# Altium schematic sheet [03] - SDCARD.SchDoc
size A3
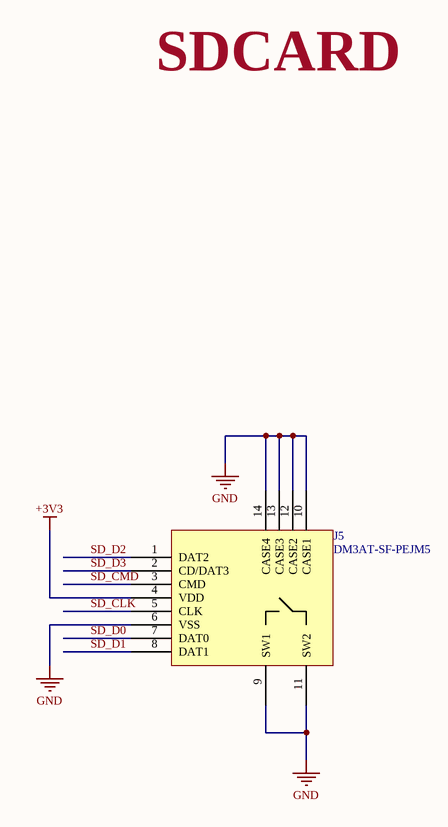
[diagram p0: [03] - SDCARD.SchDoc]

## Parts
J5  DM3AT-SF-PEJM5  [uSD_DM3AT]

## Nets
+3V3: J5.4(VDD)
GND: J5.6(VSS) J5.9(SW1) J5.10(CASE1) J5.11(SW2) J5.12(CASE2) J5.13(CASE3) J5.14(CASE4)
SD_CLK: J5.5(CLK)
SD_CMD: J5.3(CMD)
SD_D0: J5.7(DAT0)
SD_D1: J5.8(DAT1)
SD_D2: J5.1(DAT2)
SD_D3: J5.2(CD/DAT3)

## Notes on the sheet
- SDCARD

## Library data of the parts
J5 = DM3AT-SF-PEJM5: CONN MICRO SD R/A PUSH-PUSH SMD; Manufacturer: Hirose Electric Co Ltd; .Checked PCB: MM; Connector Type: Connector and Ejector; Card Type: Secure Digital - microSD TransFlash; Number of Positions: 10 (8 + 2); Insertion, Removal Method: Push In, Push Out; .Checked SCH: MM; Category: Connectors, Interconnects; Supplier Part Number: HR1964CT-ND; Family: Memory - PC Card Connectors; Manufacturer Part Number: DM3AT-SF-PEJM5; Price 1k [$]: 1.85200; Supplier: Digikey; Supplier 1: Digi-Key; Supplier Part Number 1: HR1964CT-ND; RoHS: RoHS Compliant; Stock 1: 7044; Pricing 1: 1=2.96, 10=2.457, 50=2.0476, 100=1.82, 250=1.5106, 500=1.365 (USD); Ejector Side: -; Mounting Type: Surface Mount, Right Angle; Features: Switch; Height Above Board: 0.066" (1.68mm); Mounting Feature: Normal, Standard - Top; Packaging: Cut Tape (CT); Contact Finish: Gold; Contact Finish Thickness: -; ComponentLink1URL: http://www.hirose.co.jp/cataloge_hp/e60900232.pdf; ComponentLink1Description: http://www.hirose.co.jp/cataloge_hp/e60900232.pdf